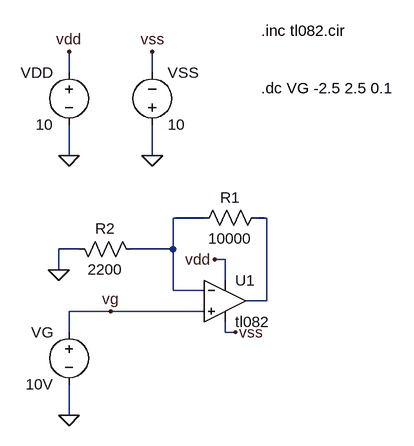
[diagram p0: schematic DCsweep.asc]
DCsweep.asc, the LTspice schematic file:
Version 4
SHEET 1 948 680
WIRE -64 -176 -64 -208
WIRE 64 -176 64 -208
WIRE -64 -48 -64 -96
WIRE 64 -48 64 -96
WIRE 144 48 96 48
WIRE 240 48 224 48
WIRE -48 96 -80 96
WIRE 96 96 96 48
WIRE 96 96 32 96
WIRE 176 112 160 112
WIRE -80 128 -80 96
WIRE 176 144 176 112
WIRE 96 160 96 96
WIRE 144 160 96 160
WIRE 240 176 240 48
WIRE 240 176 208 176
WIRE 0 192 -64 192
WIRE 144 192 0 192
WIRE -64 224 -64 192
WIRE 176 224 176 208
WIRE 192 224 176 224
WIRE -64 352 -64 304
FLAG -64 352 0
FLAG -64 -48 0
FLAG 64 -48 0
FLAG -64 -208 vdd
FLAG 160 112 vdd
FLAG 64 -208 vss
FLAG 192 224 vss
FLAG 0 192 vg
FLAG -80 128 0
SYMBOL voltage -64 208 M0
WINDOW 123 0 0 Left 0
WINDOW 39 0 0 Left 0
SYMATTR InstName VG
SYMATTR Value 10V
SYMBOL voltage -64 -192 M0
SYMATTR InstName VDD
SYMATTR Value 10
SYMBOL voltage 64 -80 M180
WINDOW 0 24 96 Left 2
WINDOW 3 24 16 Left 2
SYMATTR InstName VSS
SYMATTR Value 10
SYMBOL Opamps\\opamp2 176 112 R0
SYMATTR InstName U1
SYMATTR Value tl082
SYMBOL res 240 32 R90
WINDOW 0 0 56 VBottom 2
WINDOW 3 32 56 VTop 2
SYMATTR InstName R1
SYMATTR Value 10000
SYMBOL res 48 112 M270
WINDOW 0 32 56 VTop 2
WINDOW 3 0 56 VBottom 2
SYMATTR InstName R2
SYMATTR Value 2200
TEXT 232 -240 Left 2 !.inc tl082.cir
TEXT 232 -152 Left 2 !.dc VG -2.5 2.5 0.1

The netlist it stands for:
* DCsweep.asc
VG vg 0 10V
VDD vdd 0 10
VSS 0 vss 10
XU1 vg N001 vdd vss N002 tl082  ; pins In+ In- V+ V- OUT
R1 N002 N001 10000
R2 N001 0 2200
.inc tl082.cir
.dc VG -2.5 2.5 0.1
.backanno
.end